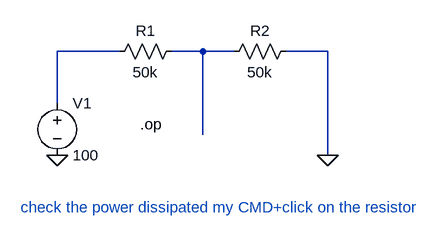
[diagram p0: schematic vd5.asc]
vd5.asc, the LTspice schematic file:
Version 4
SHEET 1 880 680
WIRE 384 256 288 256
WIRE 512 256 464 256
WIRE 560 256 512 256
WIRE 704 256 640 256
WIRE 288 336 288 256
WIRE 512 384 512 256
WIRE 704 416 704 256
FLAG 288 416 0
FLAG 704 416 0
SYMBOL voltage 288 320 R0
SYMATTR InstName V1
SYMATTR Value 100
SYMBOL Res 480 240 R90
WINDOW 0 0 56 VBottom 2
WINDOW 3 32 56 VTop 2
SYMATTR InstName R1
SYMATTR Value 50k
SYMBOL Res 656 240 R90
WINDOW 0 0 56 VBottom 2
WINDOW 3 32 56 VTop 2
SYMATTR InstName R2
SYMATTR Value 50k
TEXT 416 368 Left 2 !.op
TEXT 232 496 Left 2 ;check the power dissipated my CMD+click on the resistor

The netlist it stands for:
* vd5.asc
V1 N001 0 100
R1 N002 N001 50k
R2 0 N002 50k
.op
* check the power dissipated my CMD+click on the resistor
.backanno
.end